# Altium schematic sheet [6]-H3_MAIN.SchDoc
size A4
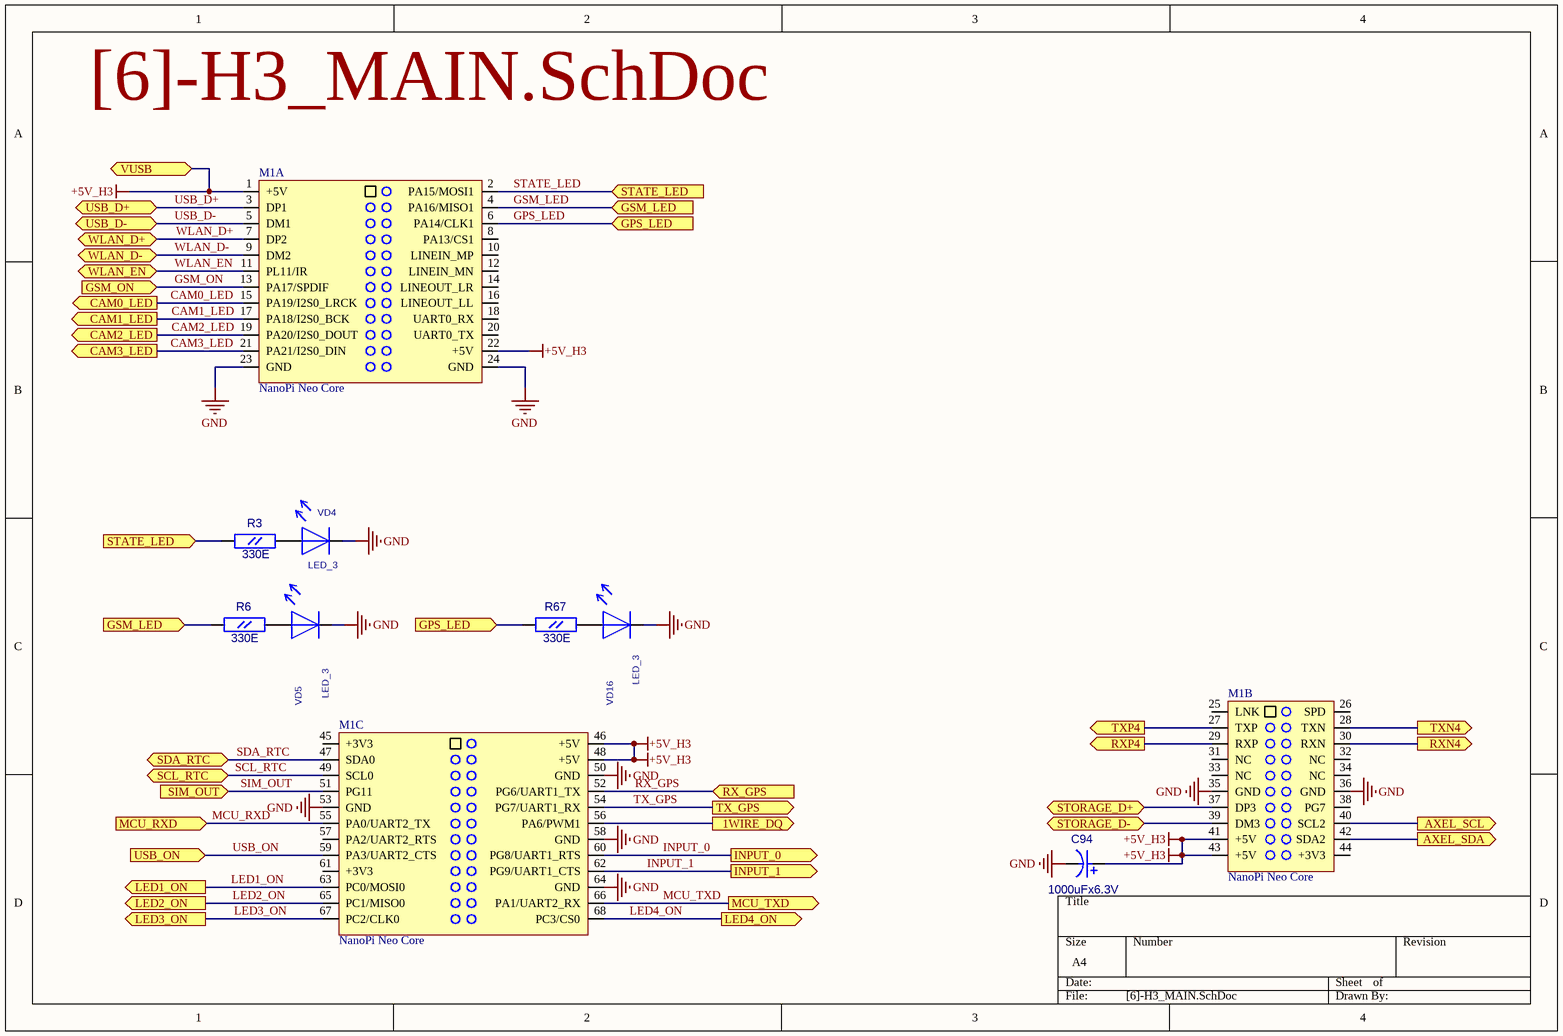
[diagram p0: [6]-H3_MAIN.SchDoc]

## Parts
C94  1000uFx6.3V  [CC8X3.5]
M1  NanoPi Neo Core  [NanoPiNeo_CORE]  (parts A,B,C of 3)
R3  330E  [RC0603]
R6  330E  [RC0603]
R67  330E  [RC0603]
VD4  LED_3  [LED3]
VD5  LED_3  [LED3]
VD16  LED_3  [LED3]

## Ports
1WIRE_DQ (out), AXEL_SCL (out), AXEL_SDA (out), CAM0_LED (out), CAM1_LED (out), CAM2_LED (out), CAM3_LED (out), GPS_LED (in), GSM_LED (in), GSM_ON (in), INPUT_0 (out), INPUT_1 (out), LED1_ON (out), LED2_ON (out), LED3_ON (out), LED4_ON (out), MCU_RXD (in), MCU_TXD (out), RX_GPS (in), RXN4 (out), RXP4 (out), SCL_RTC (bidir), SDA_RTC (bidir), SIM_OUT (in), STATE_LED (in), STORAGE_D+ (bidir), STORAGE_D- (bidir), TX_GPS (out), TXN4 (out), TXP4 (out), USB_D+ (bidir), USB_D- (bidir), USB_ON (in), VUSB (bidir), WLAN_D+ (bidir), WLAN_D- (bidir), WLAN_EN (bidir)

## Nets
+5V_H3: C94.1 M1.1(+5V) M1.22(+5V) M1.41(+5V) M1.43(+5V) M1.46(+5V) M1.48(+5V) ; port VUSB
GND: C94.2 M1.23(GND) M1.24(GND) M1.35(GND) M1.36(GND) M1.50(GND) M1.53(GND) M1.58(GND) M1.64(GND) VD4.1 VD5.1 VD16.1
1WIRE_DQ: M1.56(PA6/PWM1) ; port 1WIRE_DQ
AXEL_SCL: M1.40(SCL2) ; port AXEL_SCL
AXEL_SDA: M1.42(SDA2) ; port AXEL_SDA
CAM0_LED: M1.15(PA19/I2S0_LRCK) ; port CAM0_LED
CAM1_LED: M1.17(PA18/I2S0_BCK) ; port CAM1_LED
CAM2_LED: M1.19(PA20/I2S0_DOUT) ; port CAM2_LED
CAM3_LED: M1.21(PA21/I2S0_DIN) ; port CAM3_LED
GPS_LED: M1.6(PA14/CLK1) R67.1(A) ; port GPS_LED
GSM_LED: M1.4(PA16/MISO1) R6.1(A) ; port GSM_LED
GSM_ON: M1.13(PA17/SPDIF) ; port GSM_ON
INPUT_0: M1.60(PG8/UART1_RTS) ; port INPUT_0
INPUT_1: M1.62(PG9/UART1_CTS) ; port INPUT_1
LED1_ON: M1.63(PC0/MOSI0) ; port LED1_ON
LED2_ON: M1.65(PC1/MISO0) ; port LED2_ON
LED3_ON: M1.67(PC2/CLK0) ; port LED3_ON
LED4_ON: M1.68(PC3/CS0) ; port LED4_ON
MCU_RXD: M1.55(PA0/UART2_TX) ; port MCU_RXD
MCU_TXD: M1.66(PA1/UART2_RX) ; port MCU_TXD
RX_GPS: M1.52(PG6/UART1_TX) ; port RX_GPS
RXN4: M1.30(RXN) ; port RXN4
RXP4: M1.29(RXP) ; port RXP4
SCL_RTC: M1.49(SCL0) ; port SCL_RTC
SDA_RTC: M1.47(SDA0) ; port SDA_RTC
SIM_OUT: M1.51(PG11) ; port SIM_OUT
STATE_LED: M1.2(PA15/MOSI1) R3.1(A) ; port STATE_LED
STORAGE_D+: M1.37(DP3) ; port STORAGE_D+
STORAGE_D-: M1.39(DM3) ; port STORAGE_D-
TX_GPS: M1.54(PG7/UART1_RX) ; port TX_GPS
TXN4: M1.28(TXN) ; port TXN4
TXP4: M1.27(TXP) ; port TXP4
USB_D+: M1.3(DP1) ; port USB_D+
USB_D-: M1.5(DM1) ; port USB_D-
USB_ON: M1.59(PA3/UART2_CTS) ; port USB_ON
WLAN_D+: M1.7(DP2) ; port WLAN_D+
WLAN_D-: M1.9(DM2) ; port WLAN_D-
WLAN_EN: M1.11(PL11/IR) ; port WLAN_EN
NetR3_2: R3.2(B) VD4.2
NetR6_2: R6.2(B) VD5.2
NetR67_2: R67.2(B) VD16.2

Not connected (* = marked no-connect by the designer): M1 8(PA13/CS1) 10(LINEIN_MP) 12(LINEIN_MN) 14(LINEOUT_LR) 16(LINEOUT_LL) 18(UART0_RX) 20(UART0_TX) 25(LNK) 26(SPD) 31(NC) 32(NC) 33(NC) 34(NC) 38(PG7) 44(+3V3) 45(+3V3) 57(PA2/UART2_RTS) 61(+3V3)

## Library data of the parts
C94 = CAP_8mm: Radial capacitor; Value: 1000uFx6.3V
M1 = NanoPi Neo Core: Nano Pi Neo Core Allwinner H3 based embedded module; Value: NanoPi Neo Core
R3 R6 R67 = RC0603: Value: 330E
VD4 VD5 VD16 = LED_3: Value: *